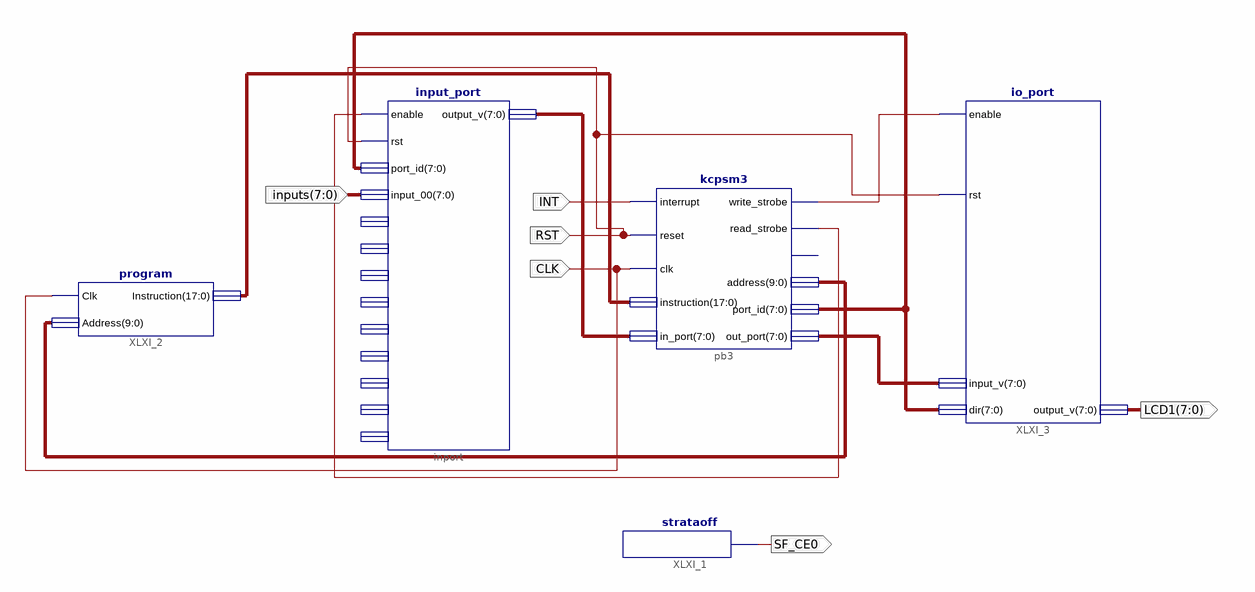
[diagram p0: schematic sheet 1]
// Xilinx ISE schematic todo.sch (spartan3e) as structural Verilog: 5 symbols, 6 ports
module todo (
  input  CLK,
  input  RST,
  input  INT,
  input  [7:0] inputs,
  output SF_CE0,
  output [7:0] LCD1
);

  wire XLXN_2, XLXN_5;
  wire [7:0] XLXN_1, XLXN_4, XLXN_10;
  wire [9:0] XLXN_9;
  wire [17:0] XLXN_8;

  kcpsm3 pb3 (
    .interrupt(INT), .reset(RST), .clk(CLK), .instruction(XLXN_8), .in_port(XLXN_1), .write_strobe(XLXN_5),
    .read_strobe(XLXN_2), .address(XLXN_9), .port_id(XLXN_4), .out_port(XLXN_10));  // open: interrupt_ack
  input_port inport (
    .enable(XLXN_2), .rst(RST), .port_id(XLXN_4), .input_00(inputs), .output_v(XLXN_1));  // open: input_01, input_02, input_03, input_04, input_05, input_06, input_07, input_08, input_09
  strataoff XLXI_1 (.op(SF_CE0));
  \program  XLXI_2 (.Clk(CLK), .Address(XLXN_9), .Instruction(XLXN_8));
  io_port XLXI_3 (.enable(XLXN_5), .rst(RST), .input_v(XLXN_10), .dir(XLXN_4), .output_v(LCD1));
endmodule
